# Altium schematic sheet High Voltage Power Supply.SchDoc: HVPS
size 431 x 279 mm; Date: Not shown in title block; ApprovedBy: Not shown in title block; CheckedBy: Not shown in title block; Author: Not shown in title block; CompanyName: Not shown in title block; DrawnBy: Abhishek Vishwa; Engineer: Not shown in title block; Organization: Not shown in title block; Address1: Not shown in title block; Address2: Not shown in title block; Address3: Not shown in title block; Address4: Not shown in title block; DocumentNumber: 1; Revision: Use project parameter SCH_Rev; SheetNumber: 10; SheetTotal: 12; PageSetup: Record=PageOptions|CenterHorizontal=True|CenterVertical=True|PrintScale=1.00|XCorrection=1.00|YCorrection=1.00|PrintKind=0|BorderSize=5000000|LeftOffset=0|BottomOffset=0|Orientation=2|PaperLength=1000|PaperWidth=1000|Scale=100|PaperSource=15|PrintQuality=600|MediaType=1|DitherType=10|PaperKind=Letter|PrintScaleMode=1; CurrentTime: Not shown in title block; CurrentDate: Not shown in title block; Time: Not shown in title block; DocumentFullPathAndName: Not shown in title block; DocumentName: Not shown in title block; ModifiedDate: Not shown in title block; ImagePath: Not shown in title block
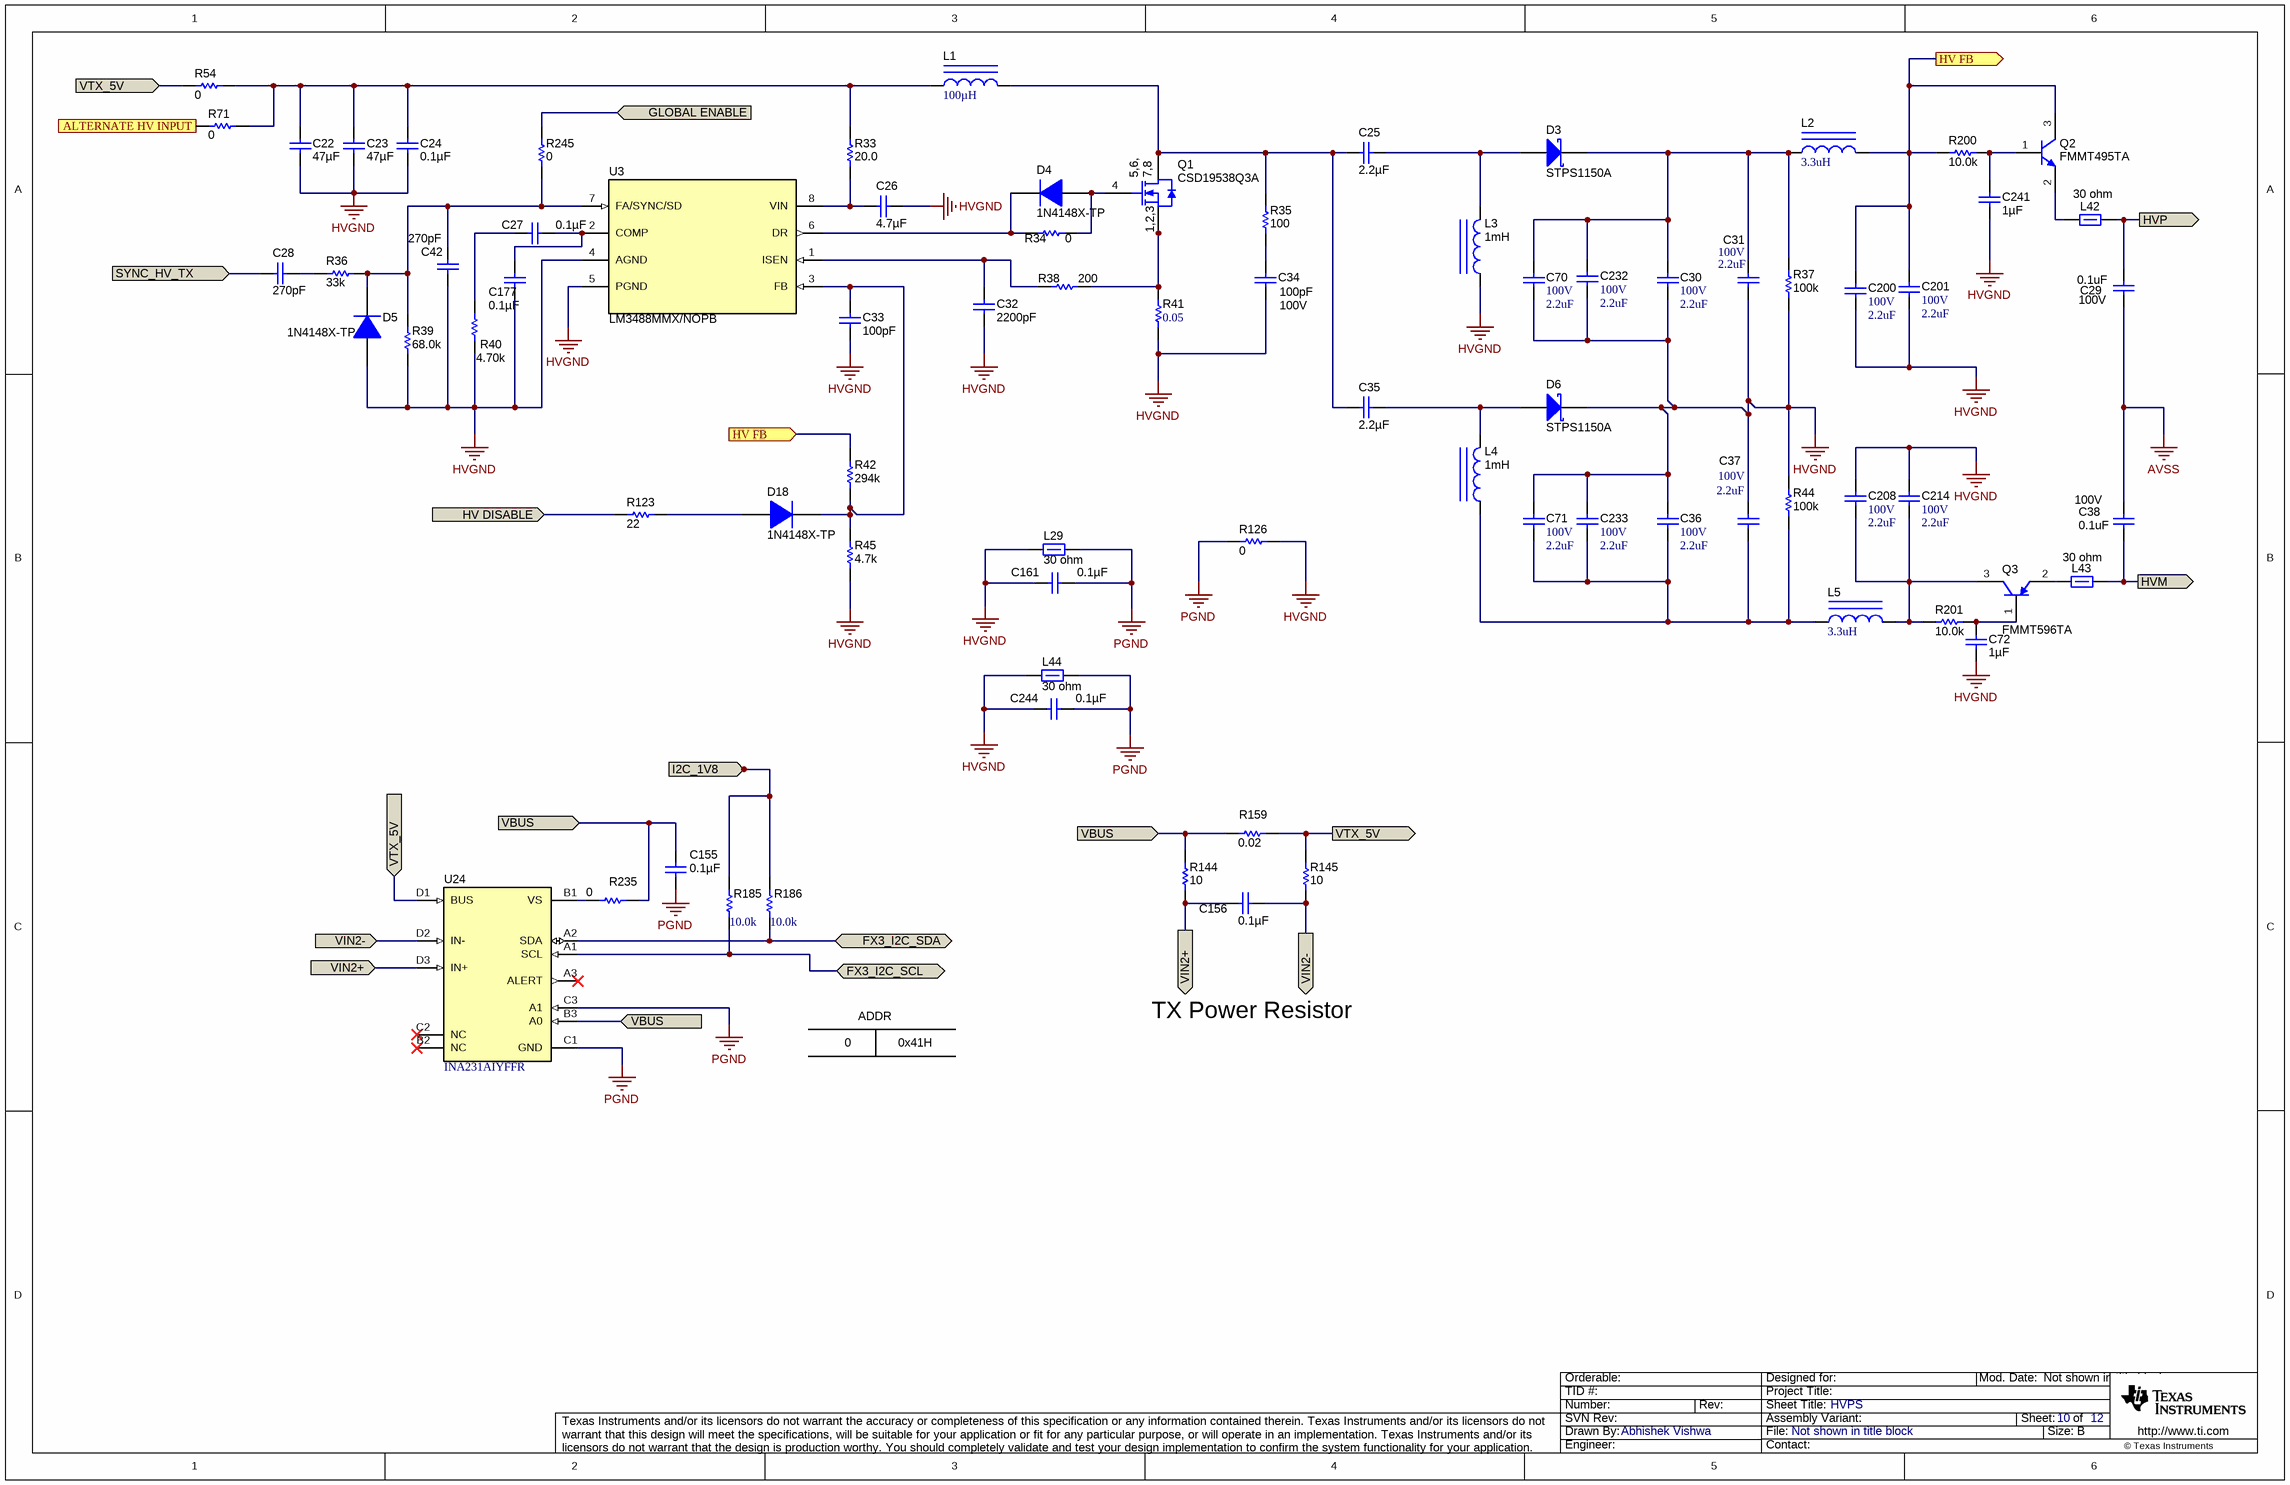
[diagram p0: High Voltage Power Supply.SchDoc]

## Parts
C22  ValueDisplayed: 47µF  [0805M]  (hidden comment: GRM21BR61A476ME15)
C23  ValueDisplayed: 47µF  [0805M]  (hidden comment: GRM21BR61A476ME15)
C24  ValueDisplayed: 0.1µF  [0805M]  (hidden comment: 08053C104KAT2A)
C25  ValueDisplayed: 2.2µF  [0805_HV]  (hidden comment: CGA4J3X7R1H225K125AB)
C26  ValueDisplayed: 4.7µF  [0603]  (hidden comment: GRM188C81E475KE11D)
C27  ValueDisplayed: 0.1µF  [0402]  (hidden comment: GRM155R61E104KA87D)
C28  ValueDisplayed: 270pF  [0603]  (hidden comment: GRM1885C1H271JA01D)
C29  VDC_V: 100V  ValueDisplayed: 0.1uF  [0603]  (hidden comment: GRM188R72A104KA35J)
C30  VDC_V: 100V  ValueDisplayed: 2.2uF  [1206_180]  (hidden comment: C3216X7S2A225K160AB)
C31  VDC_V: 100V  ValueDisplayed: 2.2uF  [1206_180]  (hidden comment: C3216X7S2A225K160AB)
C32  ValueDisplayed: 2200pF  [0402]  (hidden comment: 885012205027)  (graphical)
C33  ValueDisplayed: 100pF  [0402]  (hidden comment: 885012005061)
C34  VDC_V: 100V  ValueDisplayed: 100pF  [0603]  (hidden comment: GRM1885C2A101JA01D)
C35  ValueDisplayed: 2.2µF  [0805_HV]  (hidden comment: CGA4J3X7R1H225K125AB)
C36  VDC_V: 100V  ValueDisplayed: 2.2uF  [1206_180]  (hidden comment: C3216X7S2A225K160AB)
C37  VDC_V: 100V  ValueDisplayed: 2.2uF  [1206_180]  (hidden comment: C3216X7S2A225K160AB)
C38  VDC_V: 100V  ValueDisplayed: 0.1uF  [0603]  (hidden comment: GRM188R72A104KA35J)
C42  ValueDisplayed: 270pF  [0603]  (hidden comment: GRM1885C1H271JA01D)
C70  VDC_V: 100V  ValueDisplayed: 2.2uF  [1206_180]  (hidden comment: C3216X7S2A225K160AB)
C71  VDC_V: 100V  ValueDisplayed: 2.2uF  [1206_180]  (hidden comment: C3216X7S2A225K160AB)
C72  ValueDisplayed: 1µF  [0805_HV]  (hidden comment: C2012X7S2A105K125AB)
C155  ValueDisplayed: 0.1µF  [0201_033]  (hidden comment: C0603X6S1C104K030BC)
C156  ValueDisplayed: 0.1µF  [0201_033]  (hidden comment: C0603X6S1C104K030BC)
C161  ValueDisplayed: 0.1µF  [0402]  (hidden comment: GRM155R61E104KA87D)
C177  ValueDisplayed: 0.1µF  [0402]  (hidden comment: GRM155R61E104KA87D)
C200  VDC_V: 100V  ValueDisplayed: 2.2uF  [1206_180]  (hidden comment: C3216X7S2A225K160AB)
C201  VDC_V: 100V  ValueDisplayed: 2.2uF  [1206_180]  (hidden comment: C3216X7S2A225K160AB)
C208  VDC_V: 100V  ValueDisplayed: 2.2uF  [1206_180]  (hidden comment: C3216X7S2A225K160AB)
C214  VDC_V: 100V  ValueDisplayed: 2.2uF  [1206_180]  (hidden comment: C3216X7S2A225K160AB)
C232  VDC_V: 100V  ValueDisplayed: 2.2uF  [1206_180]  (hidden comment: C3216X7S2A225K160AB)
C233  VDC_V: 100V  ValueDisplayed: 2.2uF  [1206_180]  (hidden comment: C3216X7S2A225K160AB)
C241  ValueDisplayed: 1µF  [0805_HV]  (hidden comment: C2012X7S2A105K125AB)
C244  ValueDisplayed: 0.1µF  [0402]  (hidden comment: GRM155R61E104KA87D)
D3  STPS1150A  [SMA]
D4  1N4148X-TP  [SOD-523]
D5  1N4148X-TP  [SOD-523]
D6  STPS1150A  [SMA]
D18  1N4148X-TP  [SOD-523]
L1  ValueDisplayed: 100µH  [WE-LQS_8040]  (hidden comment: 74404084101)
L2  ValueDisplayed: 3.3uH  [0805_HV]  (hidden comment: 74479775233)
L3  ValueDisplayed: 1mH  [WE-TPC_4828]  (hidden comment: 744043102)
L4  ValueDisplayed: 1mH  [WE-TPC_4828]  (hidden comment: 744043102)
L5  ValueDisplayed: 3.3uH  [0805_HV]  (hidden comment: 74479775233)
L29  ValueDisplayed: 30 ohm  [0603]  (hidden comment: 742792609)
L42  ValueDisplayed: 30 ohm  [0603]  (hidden comment: 742792609)
L43  ValueDisplayed: 30 ohm  [0603]  (hidden comment: 742792609)
L44  ValueDisplayed: 30 ohm  [0603]  (hidden comment: 742792609)
Q1  CSD19538Q3A  [DNH0008A]
Q2  FMMT495TA  [SOT-23]
Q3  FMMT596TA  [SOT-23]
R33  ValueDisplayed: 20.0  [0603]  (hidden comment: RT0603BRD0720RL)
R34  ValueDisplayed: 0  [0603]  (hidden comment: RC0603JR-070RL)
R35  ValueDisplayed: 100  [0603]  (hidden comment: CRCW0603100RJNEA)
R36  ValueDisplayed: 33k  [0603]  (hidden comment: RC0603JR-0733KL)
R37  ValueDisplayed: 100k  [0603]  (hidden comment: CRCW0603100KJNEAC)
R38  ValueDisplayed: 200  [0603]  (hidden comment: CRCW0603200RFKEA)
R39  ValueDisplayed: 68.0k  [0603]  (hidden comment: RC0603FR-0768KL)
R40  ValueDisplayed: 4.70k  [0402]  (hidden comment: ERJ-2RKF4701X)
R41  ValueDisplayed: 0.05  [2010]
R42  ValueDisplayed: 294k  [0603]  (hidden comment: ERJ-3EKF2943V)
R44  ValueDisplayed: 100k  [0603]  (hidden comment: CRCW0603100KJNEAC)
R45  ValueDisplayed: 4.7k  [0603]  (hidden comment: ERA-3AEB5111V)
R54  ValueDisplayed: 0  [5106]  (hidden comment: 5106)
R71  ValueDisplayed: 0  [5106]  (hidden comment: 5106)
R123  ValueDisplayed: 22  [0402]  (hidden comment: CRCW040222R0JNED)
R126  ValueDisplayed: 0  [5106]  (hidden comment: 5106)
R144  ValueDisplayed: 10  [0201]  (hidden comment: RC0201JR-0710RL)
R145  ValueDisplayed: 10  [0201]  (hidden comment: RC0201JR-0710RL)
R159  ValueDisplayed: 0.02  [1206]  (hidden comment: CSR1206FK20L0)
R185  ValueDisplayed: 10.0k  [0201]  (hidden comment: RC0201FS-7D10KL)
R186  ValueDisplayed: 10.0k  [0201]  (hidden comment: RC0201FS-7D10KL)
R200  ValueDisplayed: 10.0k  [0603]  (hidden comment: RT0603BRD0710KL)
R201  ValueDisplayed: 10.0k  [0603]  (hidden comment: RT0603BRD0710KL)
R235  ValueDisplayed: 0  [0201]  (hidden comment: ERJ-1GN0R00C)
R245  ValueDisplayed: 0  [0402]  (hidden comment: ERJ-2GE0R00X)
U3  LM3488MMX/NOPB  [DGK0008A_N]
U24  INA231AIYFFR  [YFF0012AKAD]

## Ports
ALTERNATE HV INPUT (in), FX3_I2C_SCL (bidir), FX3_I2C_SDA (bidir), GLOBAL ENABLE (in), HV DISABLE (in), HV FB (in), HV FB (out), HVM (out), HVP (out), I2C_1V8 (in), SYNC_HV_TX (in), VBUS (in), VIN2+ (in), VIN2+ (out), VIN2- (in), VIN2- (out), VTX_5V (in), VTX_5V (out)

## Nets
AVSS: C29.2 C38.1
HVGND: C22.2 C23.2 C24.2 C26.1 C30.2 C31.2 C32.2 C33.2 C34.2 C36.1 C37.1 C42.2 C70.2 C71.1 C72.2 C161.2 C177.2 C200.2 C201.2 C208.1 C214.1 C232.2 C233.1 C241.2 C244.2 D5.2(A) D6.1(K) L3.1 L29.1 L44.1 R37.1 R39.1 R40.1 R41.1 R44.2 R45.1 R126.2 U3.4(AGND) U3.5(PGND)
PGND: C155.2 C161.1 C244.1 L29.2 L44.2 R126.1 U24.C1(GND) U24.C3(A1)
ALTERNATE HV INPUT: R71.1 ; port ALTERNATE HV INPUT
FX3_I2C_SCL: R185.1 U24.A1(SCL) ; port FX3_I2C_SCL
FX3_I2C_SDA: R186.1 U24.A2(SDA) ; port FX3_I2C_SDA
GLOBAL ENABLE: R245.1 ; port GLOBAL ENABLE
HV DISABLE: R123.1 ; port HV DISABLE
HV FB: C200.1 C201.1 L2.2 Q2.3(C) R42.2 R200.1 ; port HV FB
HVM: C38.2 L43.2 ; port HVM
HVP: C29.1 L42.2 ; port HVP
I2C_1V8: R185.2 R186.2 ; port I2C_1V8
SYNC_HV_TX: C28.1 ; port SYNC_HV_TX
VBUS: C155.1 R144.2 R159.1 R235.2 U24.B3(A0) ; port VBUS
VIN2+: C156.1 R144.1 U24.D3(IN+) ; port VIN2+
VIN2-: C156.2 R145.1 U24.D2(IN-) ; port VIN2-
VTX_5V: R54.1 R145.2 R159.2 U24.D1(BUS) ; port VTX_5V
NetC22_1: C22.1 C23.1 C24.1 L1.1 R33.2 R54.2 R71.2
NetC25_1: C25.1 D3.2(A) L3.2
NetC25_2: C25.2 C35.2 L1.2 Q1.5(D) Q1.6(D) Q1.7(D) Q1.8(D) Q1.9(D) R35.2
NetC26_2: C26.2 R33.1 U3.8(VIN)
NetC27_1: C27.1 C177.1 U3.2(COMP)
NetC27_2: C27.2 R40.2
NetC28_2: C28.2 R36.1
NetC30_1: C30.1 C31.1 C70.1 C232.1 D3.1(K) L2.1 R37.2
NetC32_1: C32.1 R38.1 U3.1(ISEN)
NetC33_1: C33.1 D18.1(K) R42.1 R45.2 U3.3(FB)
NetC34_1: C34.1 R35.1
NetC35_1: C35.1 D6.2(A) L4.2
NetC36_2: C36.2 C37.2 C71.2 C233.2 L4.1 L5.1 R44.1
NetC42_1: C42.1 D5.1(K) R36.2 R39.2 R245.2 U3.7(FA/SYNC/SD)
NetC72_1: C72.1 Q3.1(B) R201.2
NetC208_2: C208.2 C214.2 L5.2 Q3.3(C) R201.1
NetC241_1: C241.1 Q2.1(B) R200.2
NetD4_1: D4.1(K) R34.1 U3.6(DR)
NetD4_2: D4.2(A) Q1.4(G) R34.2
NetD18_2: D18.2(A) R123.2
NetL42_1: L42.1 Q2.2(E)
NetL43_1: L43.1 Q3.2(E)
NetQ1_1: Q1.1(S) Q1.2(S) Q1.3(S) R38.2 R41.2
NetR235_1: R235.1 U24.B1(VS)

Not connected (* = marked no-connect by the designer): U24 A3(ALERT)* B2(NC)* C2(NC)*

## Notes on the sheet
- 0
- ADDR
- 0x41H
- TX Power Resistor
- Drawn By:
- SVN Rev:
- Number:
- TID #:
- Orderable:
- Rev:
- Sheet Title:
- File:
- Project Title:
- Designed for:
- Assembly Variant:
- Mod. Date:
- Sheet:
- Size:
- of
- B
- http://www.ti.com
- Texas Instruments and/or its licensors do not warrant the accuracy or completeness of this specification or any information contained therein. Texas Instruments and/or its licensors do not warrant that this design will meet the specifications, will be suitable for your application or fit for any particular purpose, or will operate in an implementation. Texas Instruments and/or its licensors do not warrant that the design is production worthy. You should completely validate and test your design implementation to confirm the system functionality for your application.
- Engineer:
- Contact:
- © Texas Instruments
- (in symbol CMP-0000969-3) 5,6,; 7,8; 1,2,3

## Library data of the parts
C22 C23 = GRM21BR61A476ME15: CAP, CERM, 47 µF, 10 V,+/- 20%, X5R, 0805; Manufacturer: MuRata; Polarized: N; CompType: Capacitor; Value: 47uF; U/M: EA; Cap_F: 0.000047; Tolerance_%: 20; VDC_V: 10; Value2: 10V; TaMin_C: -55; TaMax_C: 85; Cap_Case: 0805; SizeArea_mm2: 2.5; SizeAreaWB_mm2: 6.75; SizeX_mm: 2; SizeY_mm: 1.25; SizeZ_mm: 1.45; AEC Category: Q200; Green_Lifecycle: Active; Green_REACh: Passed; SymbolVersion: 2008-07-09; PartNumber: GRM21BR61A476ME15; PackageReference: 0805; RoHS: Y; MountType: SMT; Technology: Ceramic; TempCo: X5R; Published: 2008-06-19; Publisher: Texas Instruments; LatestRevisionDate: 2017-06-22; ComponentLink1Description: Datasheet link; ComponentLink1URL: http://www.murata.com/~/media/webrenewal/support/library/catalog/products/capacitor/mlcc/c02e.ashx; AEC Qualified: ?; Green_EU RoHS: Passed; Green_EU RoHS-2: Incomplete
C24 = 08053C104KAT2A: CAP, CERM, 0.1 µF, 25 V,+/- 10%, X7R, 0805; Manufacturer: AVX; Polarized: N; CompType: Capacitor; Value: 0.1uF; U/M: EA; Cap_F: 0.0000001; Tolerance_%: 10; ESR_ohm: 0.28; Value1: 0.28 ohm; VDC_V: 25; Value2: 25V; TaMin_C: -55; TaMax_C: 125; Cap_Case: 0805; SizeArea_mm2: 2.5; SizeAreaWB_mm2: 6.75; SizeX_mm: 2; SizeY_mm: 1.25; SizeZ_mm: 1.45; AEC Category: Q200; Green_Lifecycle: Active; Green_REACh: Passed; SymbolVersion: 2008-07-09; PartNumber: 08053C104KAT2A; PackageReference: 0805; RoHS: Y; MountType: SMT; Technology: Ceramic; TempCo: X7R; Published: 2008-06-19; Publisher: Texas Instruments; LatestRevisionDate: 2017-06-22; ComponentLink1Description: Datasheet link; ComponentLink1URL: http://datasheets.avx.com/X7RDielectric.pdf; Supplier 1: Digi-Key; Supplier Part Number 1: 478-3755-1-ND; Supplier 2: Newark; Supplier Part Number 2: 96M1381; Supplier 3: Mouser; Supplier Part Number 3: 581-08053C104K; AEC Qualified: N; AEC Grade: N/A; Green_EU RoHS: Passed; Green_EU RoHS-2: Incomplete
C25 C35 = CGA4J3X7R1H225K125AB: CAP, CERM, 2.2 µF, 50 V,+/- 10%, X7R, AEC-Q200 Grade 1, 0805; Manufacturer: TDK; Polarized: N; CompType: Capacitor; Value: 2.2uF; U/M: EA; Cap_F: 0.0000022; Tolerance_%: 10; ESR_ohm: 0.003288; Value1: 0.003288 ohm; VDC_V: 50; Value2: 50V; IRMS_A: 3.60029; TaMin_C: -55; TaMax_C: 125; Cap_Case: 0805; SizeArea_mm2: 2.5; SizeAreaWB_mm2: 6.75; SizeX_mm: 2; SizeY_mm: 1.25; SizeZ_mm: 1.45; AEC Category: Q200; AEC Qualified: Y; AEC Grade: 1; SymbolVersion: 2008-07-09; PartNumber: CGA4J3X7R1H225K125AB; PackageReference: 0805; RoHS: Y; MountType: SMT; Technology: Ceramic; TempCo: X7R; Published: 2008-06-19; Publisher: Texas Instruments; LatestRevisionDate: 2017-06-22; ComponentLink1Description: Datasheet link; ComponentLink1URL: https://product.tdk.com/en/search/capacitor/ceramic/mlcc/info?part_no=CGA4J3X7R1H225K125AB; Supplier 1: Digi-Key; Supplier Part Number 1: 445-174216-1-ND; Supplier 2: Mouser; Supplier Part Number 2: 810-CGA4J3X7R1H225K125AB
C26 = GRM188C81E475KE11D: CAP, CERM, 4.7 µF, 25 V,+/- 10%, X6S, 0603; Manufacturer: MuRata; Polarized: N; CompType: Capacitor; Value: 4.7uF; U/M: EA; Cap_F: 0.0000047; Tolerance_%: 10; VDC_V: 25; Value2: 25V; TaMin_C: -55; TaMax_C: 105; SizeArea_mm2: 1.28; SizeAreaWB_mm2: 4.68; SizeX_mm: 1.6; SizeY_mm: 0.8; SizeZ_mm: 1; AEC Category: Q200; SymbolVersion: 2008-07-09; PartNumber: GRM188C81E475KE11D; PackageReference: 0603; RoHS: Y; MountType: SMT; Technology: Ceramic; TempCo: X6S; Cap_Case: 0603; Published: 2008-06-19; Publisher: Texas Instruments; LatestRevisionDate: 2017-06-22; ComponentLink1Description: Datasheet link; ComponentLink1URL: http://search.murata.co.jp/Ceramy/image/img/A01X/G101/ENG/GRM188C81E475KE11-01.pdf; Supplier 1: Digi-Key; Supplier Part Number 1: 490-7199-1-ND; Supplier 2: Mouser; Supplier Part Number 2: 81-GRM188C81E475KE1D; AEC Qualified: N; AEC Grade: N/A
C27 C161 C177 C244 = GRM155R61E104KA87D: CAP, CERM, 0.1 µF, 25 V,+/- 10%, X5R, 0402; Manufacturer: MuRata; Polarized: N; CompType: Capacitor; Value: 0.1uF; U/M: EA; Cap_F: 0.0000001; Tolerance_%: 10; VDC_V: 25; Value2: 25V; TaMin_C: -55; TaMax_C: 85; SizeArea_mm2: 0.5; SizeAreaWB_mm2: 3; SizeX_mm: 1; SizeZ_mm: 0.6; AEC Category: Q200; Green_Lifecycle: Active; Green_REACh: Passed; SymbolVersion: 2008-07-09; PartNumber: GRM155R61E104KA87D; PackageReference: 0402; RoHS: Y; MountType: SMT; Technology: Ceramic; TempCo: X5R; Cap_Case: 0402; SizeY_mm: 0.5; Published: 2008-06-19; Publisher: Texas Instruments; LatestRevisionDate: 2017-06-22; ComponentLink1Description: Datasheet link; ComponentLink1URL: http://psearch.murata.com/capacitor/product/GRM155R61E104KA87%23.pdf; Supplier 1: Digi-Key; Supplier Part Number 1: 490-5920-1-ND; Supplier 2: Mouser; Supplier Part Number 2: 81-GRM155R61E104KA7D; AEC Qualified: N; AEC Grade: N/A; Green_EU RoHS: Passed; Green_EU RoHS-2: Passed
C28 C42 = GRM1885C1H271JA01D: CAP, CERM, 270 pF, 50 V,+/- 5%, C0G/NP0, 0603; Manufacturer: MuRata; Polarized: N; CompType: Capacitor; Value: 270pF; U/M: EA; Cap_F: 0.00000000027; Tolerance_%: 5; VDC_V: 50; Value2: 50V; TaMin_C: -55; TaMax_C: 125; SizeArea_mm2: 1.28; SizeAreaWB_mm2: 4.68; SizeX_mm: 1.6; SizeY_mm: 0.8; SizeZ_mm: 1; AEC Category: Q200; Green_Lifecycle: Active; Green_REACh: Passed; SymbolVersion: 2008-07-09; PartNumber: GRM1885C1H271JA01D; PackageReference: 0603; RoHS: Y; MountType: SMT; Technology: Ceramic; TempCo: C0G/NP0; Cap_Case: 0603; Published: 2008-06-19; Publisher: Texas Instruments; LatestRevisionDate: 2017-06-22; ComponentLink1Description: Datasheet link; ComponentLink1URL: http://search.murata.co.jp/Ceramy/PnsearchViewAction.do?HnOFG=ON&HnNFG=ON&SEL_CNT=50&sLang=en&sKey=GRM1885C1H271JA01D&x=9&y=9&search=startwith; Supplier 1: Digi-Key; Supplier Part Number 1: 490-1437-1-ND; Supplier 2: Mouser; Supplier Part Number 2: 81-GRM39C271J50; Supplier 3: Farnell; Supplier Part Number 3: 1403568; AEC Qualified: ?; Green_EU RoHS: Passed; Green_EU RoHS-2: Incomplete
C29 C38 = CMP-0007470-5: CAP, CERM, 0.1 uF, 100 V, +/- 10%, X7R, 0603; Manufacturer: MuRata; TaMin_C: -55°C; Polarized: N; SizeAreaWB_mm2: 4.68; Value1: Unknown; U/M: EA; Value: 0.1uF; TaMax_C: 125°C; SizeZ_mm: 1; SizeX_mm: 1.6; SizeY_mm: 0.8; SizeArea_mm2: 1.28; Cap_F: 100nF; AEC Category: Q200; Supplier Part Number 2: 81-GRM188R72A104KA5J; Publisher: Texas Instruments; Supplier 2: Mouser; TempCo: X7R; Published: 2008-06-19; RoHS: Y; MountType: SMT; Supplier 1: Digi-Key; PackageReference: 0603; Tolerance_%: 10%; Cap_Case: 0603; Value2: 100V; CompType: Capacitor; LatestRevisionDate: 2017-03-09; PartNumber: GRM188R72A104KA35J; AEC Qualified: ?; ComponentLink1Description: Datasheet link; Supplier Part Number 1: 490-6439-1-ND; Technology: Ceramic; ComponentLink1URL: http://search.murata.co.jp/Ceramy/image/img/A01X/G101/ENG/GRM188R72A104KA35-01.pdf
C30 C31 C36 C37 C70 C71 C200 C201 C208 C214 C232 C233 = CMP-0008724-2: CAP, CERM, 2.2 uF, 100 V, +/- 10%, X7S, 1206; Manufacturer: TDK; TaMin_C: -55°C; ESR_ohm: 5.718m; Polarized: N; SizeAreaWB_mm2: 10.92; Value1: 0.005718 ohm; U/M: EA; Value: 2.2uF; TaMax_C: 125°C; SizeZ_mm: 1.8; SizeX_mm: 3.2; SizeY_mm: 1.6; SizeArea_mm2: 5.12; Cap_F: 2.2µF; IRMS_A: 3.03632A; AEC Category: Q200; Supplier Part Number 2: 810-C3216X7S2A225K160AB; Publisher: Texas Instruments; Supplier 2: Mouser; TempCo: X7S; Published: 2008-06-19; RoHS: Y; MountType: SMT; Supplier 1: Digi-Key; PackageReference: 1206; Tolerance_%: 10%; Cap_Case: 1206_180; Value2: 100V; CompType: Capacitor; LatestRevisionDate: 2017-03-09; PartNumber: C3216X7S2A225K160AB; AEC Qualified: N; ComponentLink1Description: Datasheet link; AEC Grade: N/A; Supplier Part Number 1: 445-5207-1-ND; Technology: Ceramic; ComponentLink1URL: https://product.tdk.com/en/search/capacitor/ceramic/mlcc/info?part_no=C3216X7S2A225K160AB
C32 = GRM155R61C222KA01D: CAP, CERM, 2200 pF, 16 V,+/- 10%, X7R, 0402; Manufacturer: Wurth Electronics Inc.; Polarized: N; CompType: Capacitor; Value: 2200pF; U/M: EA; Cap_F: 0.0000000022; Tolerance_%: 10; VDC_V: 16; Value2: 16V; TaMin_C: -55; TaMax_C: 85; SizeArea_mm2: 0.5; SizeAreaWB_mm2: 3; SizeX_mm: 1; SizeZ_mm: 0.6; AEC Category: Q200; SymbolVersion: 2008-07-09; PartNumber: 885012205027; PackageReference: 0402; RoHS: Y; MountType: SMT; Technology: Ceramic; TempCo: X7R; Cap_Case: 0402; SizeY_mm: 0.5; Published: 2008-06-19; Publisher: Texas Instruments; LatestRevisionDate: 2017-06-22; ComponentLink1Description: Datasheet link; ComponentLink1URL: http://search.murata.co.jp/Ceramy/PnsearchViewAction.do?HnOFG=ON&HnNFG=ON&SEL_CNT=50&sLang=en&sKey=GRM155R61C222KA01D&x=9&y=9&search=startwith; Supplier 1: Digi-Key; Supplier Part Number 1: 732-7522-6-ND; Supplier 2: Mouser; AEC Qualified: ?; Parameter 1: *; Parameter 2: *
C33 = 885012005061: CAP, CERM, 100 pF, 50 V,+/- 5%, C0G/NP0, 0402; Manufacturer: Wurth Elektronik; Polarized: N; CompType: Capacitor; Value: 100pF; U/M: EA; Cap_F: 0.0000000001; Tolerance_%: 5; VDC_V: 50; Value2: 50V; TaMin_C: -55; TaMax_C: 125; SizeArea_mm2: 0.5; SizeAreaWB_mm2: 3; SizeX_mm: 1; SizeZ_mm: 0.6; AEC Category: Q200; Green_Lifecycle: Not Set; Green_REACh: Incomplete; SymbolVersion: 2008-07-09; PartNumber: 885012005061; PackageReference: 0402; RoHS: Y; MountType: SMT; Technology: Ceramic; TempCo: C0G/NP0; Cap_Case: 0402; SizeY_mm: 0.5; Published: 2008-06-19; Publisher: Texas Instruments; LatestRevisionDate: 2017-06-22; ComponentLink1Description: Datasheet link; ComponentLink1URL: http://katalog.we-online.de/pbs/datasheet/885012005061.pdf; Supplier 1: Digi-Key; Supplier Part Number 1: 732-7475-1-ND; Supplier 2: Mouser; Supplier Part Number 2: 710-885012005061; AEC Qualified: N; AEC Grade: N/A; Green_EU RoHS: Incomplete; Green_EU RoHS-2: Incomplete
C34 = CMP-0007237-4: CAP, CERM, 100 pF, 100 V, +/- 5%, C0G/NP0, 0603; Manufacturer: MuRata; TaMin_C: -55°C; Polarized: N; SizeAreaWB_mm2: 4.68; Value1: Unknown; U/M: EA; Value: 100pF; TaMax_C: 125°C; SizeZ_mm: 1; SizeX_mm: 1.6; SizeY_mm: 0.8; SizeArea_mm2: 1.28; AEC Category: Q200; Supplier Part Number 2: 81-GRM1885C2A101JA01; Publisher: Texas Instruments; Supplier 2: Mouser; Supplier Part Number 3: 1828919; TempCo: C0G/NP0; Supplier 3: Farnell; Published: 2008-06-19; RoHS: Y; MountType: SMT; Supplier 1: Digi-Key; PackageReference: 0603; Tolerance_%: 5%; Cap_Case: 0603; Value2: 100V; CompType: Capacitor; LatestRevisionDate: 2017-03-09; PartNumber: GRM1885C2A101JA01D; AEC Qualified: ?; Cap_F: 100pF; ComponentLink1Description: Datasheet link; Supplier Part Number 1: 490-1351-1-ND; Technology: Ceramic; ComponentLink1URL: http://search.murata.co.jp/Ceramy/PnsearchViewAction.do?HnOFG=ON&HnNFG=ON&SEL_CNT=50&sLang=en&sKey=GRM1885C2A101JA01D&x=9&y=9&search=startwith
C72 C241 = C2012X7S2A105K125AB: CAP, CERM, 1 µF, 100 V,+/- 10%, X7S, 0805; Manufacturer: TDK; Polarized: N; CompType: Capacitor; Value: 1uF; U/M: EA; Cap_F: 0.000001; Tolerance_%: 10; ESR_ohm: 0.008255; Value1: 0.008255 ohm; VDC_V: 100; Value2: 100V; IRMS_A: 2.27442; TaMin_C: -55; TaMax_C: 125; Cap_Case: 0805; SizeArea_mm2: 2.5; SizeAreaWB_mm2: 6.75; SizeX_mm: 2; SizeY_mm: 1.25; SizeZ_mm: 1.45; AEC Category: Q200; Green_Lifecycle: Active; Green_REACh: Passed; SymbolVersion: 2008-07-09; PartNumber: C2012X7S2A105K125AB; PackageReference: 0805; RoHS: Y; MountType: SMT; Technology: Ceramic; TempCo: X7S; Published: 2008-06-19; Publisher: Texas Instruments; LatestRevisionDate: 2017-06-22; ComponentLink1Description: Datasheet link; ComponentLink1URL: https://product.tdk.com/en/search/capacitor/ceramic/mlcc/info?part_no=C2012X7S2A105K125AB; Supplier 1: Digi-Key; Supplier Part Number 1: 445-5205-1-ND; Supplier 2: Newark; Supplier Part Number 2: 90R8332; Supplier 3: Mouser; Supplier Part Number 3: 810-C2012X7S2A105K; AEC Qualified: N; AEC Grade: N/A; Green_EU RoHS: Passed; Green_EU RoHS-2: Passed
C155 C156 = C0603X6S1C104K030BC: CAP, CERM, 0.1 µF, 16 V,+/- 10%, X6S, 0201; Manufacturer: TDK; Polarized: N; CompType: Capacitor; Value: 0.1uF; U/M: EA; Cap_F: 0.0000001; Tolerance_%: 10; VDC_V: 16; Value2: 16V; TaMin_C: -55; TaMax_C: 105; Cap_Case: 0201; SizeArea_mm2: 0.18; SizeAreaWB_mm2: 2.08; SizeX_mm: 0.6; SizeY_mm: 0.3; SizeZ_mm: 0.33; AEC Category: Q200; SymbolVersion: 2008-07-09; PartNumber: C0603X6S1C104K030BC; PackageReference: 0201; RoHS: Y; MountType: SMT; Technology: Ceramic; TempCo: X6S; Published: 2008-06-19; Publisher: Texas Instruments; LatestRevisionDate: 2017-06-22; ComponentLink1Description: Datasheet link; ComponentLink1URL: http://product.tdk.com/en/catalog/datasheets/mlcc_commercial_general_en.pdf; Supplier 1: Digi-Key; Supplier Part Number 1: 445-15903-1-ND; Supplier 2: Newark; Supplier Part Number 2: 17X8592; Supplier 3: Mouser; Supplier Part Number 3: 810-C0603X6S1C104KBC; AEC Qualified: N; AEC Grade: N/A
D3 D6 = STPS1150A: Diode, Schottky, 150 V, 1 A, SMA; Manufacturer: STMicroelectronics; U/M: EA; Vf_V: 0.78; Value: 150V; Value1: 1A; Value2: 0.78V; Io_A: 1; Vr_V: 150; TJmax_C: 175; RJC_CperW: 30; SizeAreaWB_mm2: 37.3428; SizeArea_mm2: 16.3228; SizeX_mm: 5.59; SizeY_mm: 2.92; SizeZ_mm: 2.87; AEC Category: Q101; AEC Qualified: N; Green_Lifecycle: Not Set; Green_REACh: Incomplete; CompType: Diode; SymbolVersion: 2008-12-08; PartNumber: STPS1150A; PackageReference: SMA; MountType: SMT; Type: Schottky; RoHS: Y; Published: 2008-06-26; Publisher: Texas Instruments; LatestRevisionDate: 2017-06-26; ComponentLink1Description: Datasheet link; ComponentLink1URL: http://www.st.com/web/en/resource/technical/document/datasheet/CD00003321.pdf; Supplier 1: Digi-Key; Supplier Part Number 1: 497-7545-1-ND; Supplier 2: Newark; Supplier Part Number 2: 57P1608; Supplier 3: Mouser; Supplier Part Number 3: 511-STPS1150A; Green_EU RoHS: Incomplete; Green_EU RoHS-2: Incomplete
D4 D5 D18 = 1N4148X-TP: Diode, Switching, 75 V, 0.3 A, SOD-523; Manufacturer: Micro Commercial Components; U/M: EA; Vf_V: 1.25; Value: 75V; Value1: 0.3A; Value2: 1.25V; Io_A: 0.3; Vr_V: 75; TJmax_C: 150; SizeAreaWB_mm2: 5.13; SizeArea_mm2: 1.53; SizeX_mm: 1.7; SizeY_mm: 0.9; SizeZ_mm: 0.65; AEC Category: Q101; Green_Lifecycle: Not Set; Green_REACh: Incomplete; SymbolVersion: 2008-12-08; PartNumber: 1N4148X-TP; PackageReference: SOD-523; CompType: Diode; MountType: SMT; Type: Switching; RoHS: Y; Published: 2008-06-26; Publisher: Texas Instruments; LatestRevisionDate: 2017-06-26; ComponentLink1Description: Datasheet link; ComponentLink1URL: http://www.mccsemi.com/up_pdf/1N4148X(SOD-523).PDF; Supplier 1: Digi-Key; Supplier Part Number 1: 1N4148XTPMSCT-ND; Supplier 2: Newark; Supplier Part Number 2: 69R6666; Supplier 3: Mouser; Supplier Part Number 3: 833-1N4148X-TP; AEC Qualified: ?; Green_EU RoHS: Incomplete; Green_EU RoHS-2: Incomplete
L1 = CMP-0086317-1: Inductor, Shielded, Ferrite, 100 µH, 1.2 A, 0.377 ohm, SMD; Manufacturer: Wurth Elektronik; Value: 100uH; Imax_A: 1.2A; SizeArea_mm2: 64; SizeX_mm: 8; Isat: 1.5A @ 20% inductance drop; SizeZ_mm: 4.2; SizeAreaWB_mm2: 100; DCR_ohm: 0.377; AEC Category: Q200; AEC Qualified: N; Irms: 1.2A @ 40C rise; Material: Ferrite; ComponentLink1URL: https://katalog.we-online.de/pbs/datasheet/74404084101.pdf; CompType: Inductor; Value2: 1.2A; MountType: SMT; Technology: Shielded; AEC Grade: N/A; PackageReference: 8x8mm; ComponentLink1Description: Datasheet link; RoHS: Y; Value1: 0.377 ohm; PartNumber: 74404084101; SizeY_mm: 8; Ind_H: 100µH
L2 L5 = CMP-0062218-1: FIXED IND 3.3UH 700MA 200 MOHM; Manufacturer: Wurth; Green_Lifecycle: Not Set; DCR_ohm: 3.32d; Green_REACh: Incomplete; Value1: 0.2 ohm; Material: Ferrite; Value: 3.3; Imax_A: 8.5dA; Value2: 0.7; CompType: Inductor; AEC Category: Q200; ComponentLink1URL: http://www.sumida.com/products/pdf/CDH3D13DSHP.pdf; Irms: 700 mA; Supplier Part Number 2: 74479775233; Publisher: Texas Instruments; Supplier 2: Mouser; Published: 2008-06-26; RoHS: Y; MountType: SMT; Green_EU RoHS-2: Incomplete; Supplier 1: Digi-Key; Green_EU RoHS: Incomplete; PackageReference: 0805; Ind_H: 3.3uH; LatestRevisionDate: 2017-06-02; PartNumber: 74479775233; AEC Qualified: ?; ComponentLink1Description: Datasheet link; Supplier Part Number 1: 74479775233; Technology: Drum Core
L3 L4 = CMP-0064699-2: Inductor, Shielded Drum Core, Metal Composite, 1mH, 0.08 A, 5.4 ohm, SMD; Manufacturer: Wurth Elektronik; Isat: 0.08A @ 35% inductance drop; Irms: 0.14A @ 30C rise; Green_Lifecycle: Active; SizeAreaWB_mm2: 33.64; DCR_ohm: 5.4; Green_REACh: Passed; Value1: 5.4 ohm; Imax_A: 0.08A; SizeZ_mm: 3; SizeX_mm: 4.8; SizeArea_mm2: 23.04; Ind_H: 470µH; AEC Category: Q200; Publisher: Texas Instruments; Published: 2008-06-26; RoHS: Y; Material: Metal Composite; MountType: SMT; Green_EU RoHS-2: Incomplete; Value: 1mH; Supplier 1: Digi-Key; Green_EU RoHS: Passed; PackageReference: WE-TPC-M2; SizeY_mm: 4.8; Value2: 0.08A; CompType: Inductor; LatestRevisionDate: 2017-06-02; PartNumber: 744043102; AEC Qualified: ?; ComponentLink1Description: Datasheet link; Supplier Part Number 1: 732-3662-1-ND; Technology: Shielded Drum Core; ComponentLink1URL: https://katalog.we-online.de/pbs/datasheet/744043102.pdf
L29 L42-L44 = 742792609: Ferrite Bead, 30 ohm @ 100 MHz, 3 A, 0603; Manufacturer: Wurth Elektronik; Value: 30 ohm; Imax_A: 3; DCR_ohm: 0.04; Value1: 0.04 ohm; Value2: 3A; SizeAreaWB_mm2: 4.68; SizeArea_mm2: 1.28; SizeX_mm: 1.6; SizeY_mm: 0.8; SizeZ_mm: 1; ZTyp@100MHz_Ohm: 30; Ztyp@1GHz_Ohm: 40.472; Green_Lifecycle: Active; Green_REACh: Passed; SymbolVersion: 2017-01-06; PartNumber: 742792609; CompType: Ferrite Bead; MountType: SMT; PackageReference: 0603; Published: 2014-04-30; Publisher: Texas Instruments; LatestRevisionDate: 2017-06-22; ComponentLink1Description: Datasheet link; ComponentLink1URL: http://katalog.we-online.de/pbs/datasheet/742792609.pdf; RoHS: Y; Supplier 1: Digi-Key; Supplier Part Number 1: 732-1591-1-ND; Supplier 2: Mouser; Supplier Part Number 2: 710-742792609; Green_EU RoHS: Passed; Green_EU RoHS-2: Incomplete
Q1 = CMP-0000969-3: MOSFET, N-CH, 100 V, 5 A, DNH0008A (VSONP-8); Alternate Manufacturer: None; Manufacturer: Texas Instruments; SizeZ_mm: 0.9; ChType: N; Value2: 7.2 nC; VdsMax_V: 100V; SizeX_mm: 3.3; SizeAreaWB_mm2: 18.49; Vgs_V: 20V; QgTyp_nC: 7.2; Value: 100V; SizeArea_mm2: 10.89; AEC Category: Q101; IdsMax_A: 5A; ChMode: Enhancement; PartNumber: CSD19538Q3A; ComponentLink1Description: Datasheet link; SizeY_mm: 3.3; CompType: MOSFET; AEC Qualified: N; RoHS: Y; PackageReference: DNH0008A; MountType: SMT; ComponentLink1URL: http://www.ti.com/lit/ds/symlink/csd19538q3a.pdf
Q2 = CMP-0074710-1: Transistor, NPN, 150 V, 1 A, AEC-Q101, SOT-23; Manufacturer: Diodes Inc.; TaMin_C: -55°C; HfeMax: 300.0; SizeAreaWB_mm2: 14.0; Value1: 1 A; Vceo_V: 150V; U/M: EA; Value: 150 V; TaMax_C: 150°C; IcRated_A: 1A; SizeZ_mm: 1.1; SizeX_mm: 2.5; SizeY_mm: 3.0; SizeArea_mm2: 7.5; CompType: BJT; PNP: 0.0; AEC Qualified: Y; NPN: 1.0; Vcesat1_V: 3dV; AEC Category: Q101; ComponentLink1URL: https://www.diodes.com/assets/Datasheets/FMMT495.pdf; Supplier Part Number 2: 522-FMMT495TA; Publisher: Texas Instruments; Supplier 2: Mouser; Published: 2008-07-31; RoHS: Y; MountType: SMT; Supplier 1: Digi-Key; PackageReference: SOT-23; Value2: 300.0; PartNumber: FMMT495TA; LatestRevisionDate: 2017-06-26; ComponentLink1Description: Datasheet link; Supplier Part Number 1: FMMT495CT-ND
Q3 = CMP-0000370-2: Transistor, PNP, 200 V, 0.3 A, SOT-23; Manufacturer: Diodes Inc.; TaMax_C: 150°C; Value2: 300; Value1: 0.3 A; Vcesat1_V: 2dV; SizeX_mm: 2.5; SizeY_mm: 3; TaMin_C: -55°C; IcRated_A: 3dA; CompType: BJT; SizeZ_mm: 1.1; AEC Qualified: N; Value: 200 V; SizeArea_mm2: 7.5; NPN: 0; Vceo_V: 200V; PNP: 1; AEC Category: Q101; SizeAreaWB_mm2: 14; U/M: EA; Supplier 2: Mouser; Supplier 1: Digi-Key; Supplier Part Number 1: FMMT596CT-ND; Supplier Part Number 2: 522-FMMT596TA; PartNumber: FMMT596TA; LatestRevisionDate: 2017-03-09; Publisher: Texas Instruments; ComponentLink1Description: Datasheet link; HfeMax: 300; Published: 2008-07-31; RoHS: Y; PackageReference: SOT-23; MountType: SMT; ComponentLink1URL: http://www.diodes.com/_files/datasheets/FMMT596.pdf
R33 = RT0603BRD0720RL: RES, 20.0, 0.1%, 0.1 W, 0603; Manufacturer: Yageo America; CompType: Resistor; Value: 20.0; Res_ohm: 20; Value_Code: 20R0; Tolerance_%: 0.1; Value2: 0.1W; VDC_V: 75; TempCo: 25 ppm/C; SizeArea_mm2: 1.28; SizeX_mm: 1.6; SizeY_mm: 0.8; SizeZ_mm: 1; EIA_Code: E192; U/M: EA; AEC Category: Q200; Green_Lifecycle: Active; Green_REACh: Passed; SymbolVersion: 2009-05-29; PartNumber: RT0603BRD0720RL; PackageReference: 0603; RoHS: Y; Value1: 0.1%; Power_W: 0.1; MountType: SMT; Technology: Thin Film; Published: 2008-06-26; Publisher: Texas Instruments; LatestRevisionDate: 2017-06-13; ComponentLink1Description: Datasheet link; ComponentLink1URL: http://www.yageo.com/pdf/PYu-RT_1-to-0.05_RoHS_L_3.pdf; AEC Qualified: ?; Green_EU RoHS: Passed with Exemption; Green_EU RoHS-2: Passed
R34 = CMP-0025885-5: RES, 0, 5%, 0.1 W, 0603; Manufacturer: Yageo; Power_W: 100mW; TempCo: 200 ppm/C; Value_Code: 0000; Value: 0; EIA_Code: E24; SizeX_mm: 1.6; SizeZ_mm: 1; Value2: 0.1W; SizeArea_mm2: 1.28; AEC Qualified: N; VDC_V: 75V; AEC Category: Q200; SizeY_mm: 0.8; SizeAreaWB_mm2: 4.68; Supplier Part Number 2: 603-RC0603JR-070RL; Supplier 2: Mouser; Supplier Part Number 3: 9233130; Supplier 3: Farnell; RoHS: Y; Value1: 5%; MountType: SMT; Supplier 1: Digi-Key; PackageReference: 0603; Tolerance_%: 5%; Res_ohm: 0; CompType: Resistor; PartNumber: RC0603JR-070RL; ComponentLink1Description: Datasheet link; Supplier Part Number 1: 311-0.0GRCT-ND; Technology: Thick Film; ComponentLink1URL: http://www.yageo.com/pdf/Pu-RC0603_51_PbFree_L_2.pdf; AEC Grade: N/A
R35 = CMP-0025700-4: RES, 100, 5%, 0.1 W, AEC-Q200 Grade 0, 0603; Manufacturer: Vishay-Dale; Power_W: 100mW; TempCo: 200 ppm/C; Value_Code: 100R; Value: 100; EIA_Code: E24; SizeX_mm: 1.6; SizeY_mm: 0.8; SizeZ_mm: 1; Value2: 0.1W; SizeArea_mm2: 1.28; AEC Qualified: Y; VDC_V: 75V; AEC Category: Q200; AEC Grade: 0; Supplier Part Number 2: 59M6764; Supplier 2: Newark; Supplier Part Number 3: 71-CRCW0603J-100-E3; Supplier 3: Mouser; RoHS: E; Value1: 5%; MountType: SMT; Supplier 1: Digi-Key; PackageReference: 0603; Tolerance_%: 5%; Res_ohm: 100; CompType: Resistor; PartNumber: CRCW0603100RJNEA; ComponentLink1Description: Datasheet link; Supplier Part Number 1: 541-100GCT-ND; Technology: Thick Film; ComponentLink1URL: http://www.vishay.com/docs/20035/dcrcwe3.pdf
R36 = RC0603JR-0733KL: RES, 33 k, 5%, 0.1 W, 0603; Manufacturer: Yageo America; CompType: Resistor; Value: 33k; Res_ohm: 33000; Value_Code: 33k0; Tolerance_%: 5; Power_W: 0.1; Value2: 0.1W; VDC_V: 50; TempCo: 100 ppm/C; SizeArea_mm2: 1.28; SizeX_mm: 1.6; SizeY_mm: 0.8; SizeZ_mm: 1; EIA_Code: E24; U/M: EA; AEC Category: Q200; SymbolVersion: 2009-05-29; PartNumber: RC0603JR-0733KL; PackageReference: 0603; RoHS: Y; Value1: 5%; MountType: SMT; Technology: Thick Film; Published: 2008-06-26; Publisher: Texas Instruments; LatestRevisionDate: 2017-06-13; ComponentLink1Description: Datasheet link; ComponentLink1URL: http://www.yageo.com/pdf/Pu-RC0603_51_PbFree_L_2.pdf; Supplier 1: Digi-Key; Supplier Part Number 1: 311-33KGRCT-ND; Supplier 2: Mouser; Supplier Part Number 2: 603-RC0603JR-0733KL; Supplier 3: Farnell; Supplier Part Number 3: 9233563; AEC Qualified: ?
R37 R44 = CMP-0082530-1: RES, 100 k, 1%, 0.1 W, 0603; Manufacturer: Panasonic; PartNumber: ERJ-3EKF1003V; Power_W: 100mW; TempCo: 200 ppm/C; SizeAreaWB_mm2: 4.68; Value1: 5%; Value: 100k; EIA_Code: E24; SizeX_mm: 1.6; SizeY_mm: 0.8; SizeZ_mm: 1; Value2: 0.1W; SizeArea_mm2: 1.28; AEC Qualified: N; VDC_V: 75V; AEC Category: Q200; ComponentLink1URL: http://www.vishay.com/docs/28773/crcwce3.pdf; Supplier 2: Mouser; Value_Code: 100k; RoHS: E; MountType: SMT; Supplier 1: Digi-Key; PackageReference: 0603; Tolerance_%: 1%; Res_ohm: 100k; CompType: Resistor; ComponentLink1Description: Datasheet link; AEC Grade: N/A; Supplier Part Number 1: P100KHCT-ND; Technology: Thick Film
R38 = CRCW0603200RFKEA: RES, 200, 1%, 0.1 W, 0603; Manufacturer: Vishay-Dale; CompType: Resistor; Value: 200; Value_Code: 200R; Tolerance_%: 1; Power_W: 0.1; Value2: 0.1W; VDC_V: 75; TempCo: 100 ppm/C; SizeArea_mm2: 1.28; SizeX_mm: 1.6; SizeY_mm: 0.8; EIA_Code: E96; U/M: EA; AEC Category: Q200; Green_Lifecycle: Active; Green_REACh: Passed; SymbolVersion: 2009-05-29; PartNumber: CRCW0603200RFKEA; PackageReference: 0603; RoHS: Y; Res_ohm: 200; Value1: 1%; MountType: SMT; Technology: Thick Film; SizeZ_mm: 1; Published: 2008-06-26; Publisher: Texas Instruments; LatestRevisionDate: 2017-06-13; ComponentLink1Description: Datasheet link; ComponentLink1URL: http://www.vishay.com/docs/20035/dcrcwe3.pdf; Supplier 1: Digi-Key; Supplier Part Number 1: 541-200HCT-ND; Supplier 2: Newark; Supplier Part Number 2: 52K8273; Supplier 3: Mouser; Supplier Part Number 3: 71-CRCW0603-200-E3; AEC Qualified: ?; Green_EU RoHS: Passed with Exemption; Green_EU RoHS-2: Passed
R39 = RC0603FR-0768KL: RES, 68.0 k, 1%, 0.1 W, 0603; Manufacturer: Yageo America; CompType: Resistor; Value: 68.0k; Res_ohm: 68000; Value_Code: 68k0; Tolerance_%: 1; Power_W: 0.1; Value2: 0.1W; VDC_V: 150; TempCo: 200 ppm/C; SizeArea_mm2: 1.28; SizeX_mm: 1.6; SizeY_mm: 0.8; U/M: EA; AEC Category: Q200; Green_Lifecycle: Active; Green_REACh: Passed; SymbolVersion: 2009-05-29; PartNumber: RC0603FR-0768KL; PackageReference: 0603; RoHS: Y; Value1: 1%; MountType: SMT; Technology: Thick Film; SizeZ_mm: 1; Published: 2008-06-26; Publisher: Texas Instruments; LatestRevisionDate: 2017-06-13; ComponentLink1Description: Datasheet link; ComponentLink1URL: http://www.yageo.com/pdf/Pu-RC0603_51_PbFree_L_2.pdf; Supplier 1: Digi-Key; Supplier Part Number 1: 311-68.0KHRCT-ND; Supplier 2: Mouser; Supplier Part Number 2: 603-RC0603FR-0768KL; Supplier 3: Farnell; Supplier Part Number 3: 9238700; AEC Qualified: ?; Green_EU RoHS: Passed with Exemption; Green_EU RoHS-2: Passed
R40 = ERJ-2RKF4701X: RES, 4.70 k, 1%, 0.1 W, 0402; Manufacturer: Panasonic; CompType: Resistor; Value: 4.70k; Res_ohm: 4700; Value_Code: 4k70; Tolerance_%: 1; Power_W: 0.1; Value2: 0.1W; VDC_V: 50; TempCo: 100 ppm/C; SizeArea_mm2: 0.5; SizeZ_mm: 0.6; U/M: EA; AEC Category: Q200; Green_Lifecycle: Active; Green_REACh: Passed; SymbolVersion: 2009-05-29; PartNumber: ERJ-2RKF4701X; PackageReference: 0402; RoHS: Y; Value1: 1%; MountType: SMT; Technology: Thick Film; SizeX_mm: 1; SizeY_mm: 0.5; Published: 2008-06-26; Publisher: Texas Instruments; LatestRevisionDate: 2017-06-12; ComponentLink1Description: Datasheet link; ComponentLink1URL: http://industrial.panasonic.com/www-data/pdf/AOA0000/AOA0000CE2.pdf; Supplier 1: Digi-Key; Supplier Part Number 1: P4.70KLCT-ND; Supplier 2: Newark; Supplier Part Number 2: 64R5288; Supplier 3: Mouser; Supplier Part Number 3: 667-ERJ-2RKF4701X; AEC Qualified: ?; Green_EU RoHS: Passed with Exemption; Green_EU RoHS-2: Passed
R41 = CMP-0016223-3: RES 0.05 OHM 1% 1/2W 2010; Manufacturer: Vishay; PartNumber: WSL2010R0500FEA; Power_W: 750mW; TempCo: 100 ppm/C; Value_Code: 11R0; Value: 50m; EIA_Code: E96; Res_ohm: 11; SizeX_mm: 5; SizeY_mm: 2.5; SizeZ_mm: 1.66; Value2: 0.75W; SizeArea_mm2: 12.5; CompType: Resistor; AEC Qualified: Y; VDC_V: 400V; AEC Grade: 0; AEC Category: Q200; RoHS: E; Value1: 1%; MountType: SMT; Supplier 1: Digi-Key; PackageReference: 2010; Tolerance_%: 1%; ComponentLink1Description: Datasheet link; Supplier Part Number 1: WSLE-.05CT-ND; Technology: Thick Film; ComponentLink1URL: http://www.vishay.com/docs/20035/dcrcwe3.pdf
R42 = RT0603BRD07298KL: RES SMD 294K OHM 1% 1/10W 0603; Manufacturer: Panasonic Electronic Components; CompType: Resistor; Value: 298k; Res_ohm: 298000; Tolerance_%: 0.1; Value1: 0.1%; Value2: 0.1W; VDC_V: 75; TempCo: 25 ppm/C; SizeArea_mm2: 1.28; SizeX_mm: 1.6; SizeY_mm: 0.8; SizeZ_mm: 1; EIA_Code: E192; U/M: EA; AEC Category: Q200; SymbolVersion: 2009-05-29; PartNumber: ERJ-3EKF2943V; PackageReference: 0603; RoHS: Y; Value_Code: 294k; Power_W: 0.1; MountType: SMT; Technology: Thin Film; Published: 2008-06-26; Publisher: Texas Instruments; LatestRevisionDate: 2017-06-13; ComponentLink1Description: Datasheet link; ComponentLink1URL: http://www.yageo.com/pdf/PYu-RT_1-to-0.05_RoHS_L_3.pdf; AEC Qualified: ?
R45 = RG1608P-4751-B-T5: RES SMD 5.11KOHM 0.1% 1/10W 0603; Manufacturer: Panasonic Electronic Components; CompType: Resistor; Value: 5.11k; Res_ohm: 4750; Tolerance_%: 0.1; Value2: 0.1W; VDC_V: 75; TempCo: 25 ppm/C; SizeArea_mm2: 1.28; SizeX_mm: 1.6; SizeY_mm: 0.8; SizeZ_mm: 1; EIA_Code: E192; U/M: EA; AEC Category: Q200; SymbolVersion: 2009-05-29; PartNumber: ERA-3AEB5111V; PackageReference: 0603; RoHS: Y; Value_Code: 5.11k; Value1: 0.1%; Power_W: 0.1; MountType: SMT; Technology: Metal Film; Published: 2008-06-26; Publisher: Texas Instruments; LatestRevisionDate: 2017-06-13; ComponentLink1Description: Datasheet link; ComponentLink1URL: http://www.susumu.co.jp/english/pdf/products-j01-01.pdf; Supplier Part Number 1: P4.7KDBCT-ND; AEC Qualified: ?
R54 R71 R126 = 5106: RES, 0, 1%, 0.5 W, 0805; Manufacturer: Keystone; CompType: Resistor; Value: 0; Tolerance_%: 1; Power_W: 0.5; Value2: 0.5W; TempCo: ppm/C; SizeArea_mm2: 2.5; SizeX_mm: 2; SizeY_mm: 1.25; SizeZ_mm: 0.84; U/M: EA; AEC Category: Q200; AEC Qualified: N; SymbolVersion: 2009-05-29; PartNumber: 5106; PackageReference: 0805; RoHS: Y; Res_ohm: 0; Value_Code: 0; Value1: 1%; MountType: SMT; Technology: Metal Element; Published: 2008-06-26; Publisher: Texas Instruments; LatestRevisionDate: 2017-06-23; ComponentLink1Description: Datasheet link; ComponentLink1URL: http://www.keyelco.com/product-pdf.cfm?p=14039; Supplier 1: Digi-Key; Supplier Part Number 1: 36-5106CT-ND; AEC Grade: N/A
R123 = CRCW040222R0JNED: RES, 22, 5%, 0.063 W, 0402; Manufacturer: Vishay-Dale; CompType: Resistor; Value: 22; Value_Code: 22R0; Tolerance_%: 5; Power_W: 0.063; Value2: 0.063W; VDC_V: 50; TempCo: 200 ppm/C; SizeArea_mm2: 0.5; SizeX_mm: 1; SizeZ_mm: 0.6; EIA_Code: E24; U/M: EA; AEC Category: Q200; SymbolVersion: 2009-05-29; PartNumber: CRCW040222R0JNED; PackageReference: 0402; RoHS: Y; Res_ohm: 22; Value1: 5%; MountType: SMT; Technology: Thick Film; SizeY_mm: 0.5; Published: 2008-06-26; Publisher: Texas Instruments; LatestRevisionDate: 2017-06-12; ComponentLink1Description: Datasheet link; ComponentLink1URL: http://www.vishay.com/docs/20035/dcrcwe3.pdf; Supplier 1: Digi-Key; Supplier Part Number 1: 541-22JCT-ND; Supplier 2: Newark; Supplier Part Number 2: 59M6716; Supplier 3: Mouser; Supplier Part Number 3: 71-CRCW0402J-22-E3; AEC Qualified: ?
R144 R145 = RC0201JR-0710RL: RES, 10, 5%, 0.05 W, 0201; Manufacturer: Yageo America; CompType: Resistor; Value: 10; Value_Code: 10R0; Tolerance_%: 5; Power_W: 0.05; Value2: 0.05W; VDC_V: 25; TempCo: 350 ppm/C; SizeArea_mm2: 0.18; SizeX_mm: 0.6; SizeY_mm: 0.3; SizeZ_mm: 0.26; EIA_Code: E24; U/M: EA; AEC Category: Q200; AEC Qualified: N; SymbolVersion: 2009-05-29; PartNumber: RC0201JR-0710RL; PackageReference: 0201; RoHS: Y; Res_ohm: 10; Value1: 5%; MountType: SMT; Technology: Thick Film; Published: 2016-10-14; Publisher: Texas Instruments; LatestRevisionDate: 2017-04-07; ComponentLink1Description: Datasheet link; ComponentLink1URL: http://www.yageo.com/documents/recent/PYu-RC_Group_51_RoHS_L_5.pdf; Supplier 1: Digi-Key; Supplier Part Number 1: 311-10NCT-ND; Supplier 2: Mouser; Supplier Part Number 2: 603-RC0201JR-0710RL; AEC Grade: N/A
R159 = CSR1206FK20L0: RES, 0.02, 1%, 0.5 W, 1206; Manufacturer: Stackpole Electronics Inc; CompType: Resistor; Value: 0.02; Value_Code: R020; Tolerance_%: 1; Power_W: 0.5; Value2: 0.5W; TempCo: 100 ppm/C; SizeArea_mm2: 5.12; SizeX_mm: 3.2; SizeY_mm: 1.6; SizeZ_mm: 1.35; EIA_Code: E96; U/M: EA; AEC Category: Q200; SymbolVersion: 2009-05-29; PartNumber: CSR1206FK20L0; PackageReference: 1206; RoHS: Y; Res_ohm: 0.02; Value1: 1%; MountType: SMT; Technology: Thick Film; Published: 2008-06-26; Publisher: Texas Instruments; LatestRevisionDate: 2017-06-12; ComponentLink1Description: Datasheet link; ComponentLink1URL: http://www.seielect.com/Catalog/SEI-csr.pdf; Supplier 1: Digi-Key; Supplier Part Number 1: CSR1206FK20L0CT-ND; AEC Qualified: ?
R185 R186 = CMP-0028071-1: RES SMD 10K OHM 1% 1/20W 0201; Manufacturer: Samsung Electro-Mechanics; PartNumber: RC0603F103CS; Power_W: 50mW; TempCo: 200 ppm/C; Value_Code: 10k0; U/M: EA; Value: 10.0k; EIA_Code: E96; SizeX_mm: 0.6; SizeY_mm: 0.3; SizeZ_mm: 0.26; Value2: 0.05W; SizeArea_mm2: 0.18; AEC Qualified: N; VDC_V: 25V; AEC Category: Q200; ComponentLink1URL: http://www.yageo.com/documents/recent/PYu-RC_Group_51_RoHS_L_5.pdf; Publisher: Texas Instruments; Published: 2016-10-14; RoHS: Y; Value1: 1%; MountType: SMT; Supplier 1: Digi-Key; PackageReference: 0201; Tolerance_%: 1%; Res_ohm: 10k; CompType: Resistor; LatestRevisionDate: 2017-03-09; ComponentLink1Description: Datasheet link; AEC Grade: N/A; Supplier Part Number 1: 1276-3670-1-ND; Technology: Thick Film
R200 R201 = RT0603BRD0710KL: RES, 10.0 k, 0.1%, 0.1 W, 0603; Manufacturer: Yageo America; CompType: Resistor; Value: 10.0k; Res_ohm: 10000; Value_Code: 10k0; Tolerance_%: 0.1; Value2: 0.1W; VDC_V: 75; TempCo: 25 ppm/C; SizeArea_mm2: 1.28; SizeX_mm: 1.6; SizeY_mm: 0.8; SizeZ_mm: 1; EIA_Code: E192; U/M: EA; AEC Category: Q200; Green_Lifecycle: Active; Green_REACh: Passed; SymbolVersion: 2009-05-29; PartNumber: RT0603BRD0710KL; PackageReference: 0603; RoHS: Y; Value1: 0.1%; Power_W: 0.1; MountType: SMT; Technology: Thin Film; Published: 2008-06-26; Publisher: Texas Instruments; LatestRevisionDate: 2017-06-13; ComponentLink1Description: Datasheet link; ComponentLink1URL: http://www.yageo.com/pdf/PYu-RT_1-to-0.05_RoHS_L_3.pdf; AEC Qualified: ?; Green_EU RoHS: Passed with Exemption; Green_EU RoHS-2: Passed
R235 = ERJ-1GN0R00C: RES, 0, 5%, 0.05 W, AEC-Q200 Grade 0, 0201; Manufacturer: Panasonic; CompType: Resistor; Value: 0; Value_Code: 0000; Tolerance_%: 5; Power_W: 0.05; Value2: 0.05W; TempCo: ppm/C; SizeArea_mm2: 0.18; SizeX_mm: 0.6; SizeY_mm: 0.3; SizeZ_mm: 0.26; EIA_Code: E24; U/M: EA; AEC Category: Q200; AEC Qualified: Y; SymbolVersion: 2009-05-29; PartNumber: ERJ-1GN0R00C; PackageReference: 0201; RoHS: Y; Res_ohm: 0; Value1: 5%; MountType: SMT; Technology: Thick Film; Published: 2016-10-14; Publisher: Texas Instruments; LatestRevisionDate: 2017-04-07; ComponentLink1Description: Datasheet link; ComponentLink1URL: https://industrial.panasonic.com/cdbs/www-data/pdf/RDA0000/AOA0000C281.pdf; Supplier 1: Digi-Key; Supplier Part Number 1: P15979CT-ND; Supplier 2: Newark; Supplier Part Number 2: 51W5934; Supplier 3: Mouser; Supplier Part Number 3: 667-ERJ-1GN0R00C; AEC Grade: 0
R245 = ERJ-2GE0R00X: RES, 0, 5%, 0.063 W, 0402; Manufacturer: Panasonic; CompType: Resistor; Value: 0; Value_Code: 0000; Tolerance_%: 5; Power_W: 0.063; Value2: 0.063W; VDC_V: 50; TempCo: 600 ppm/C; SizeArea_mm2: 0.5; SizeX_mm: 1; SizeZ_mm: 0.6; EIA_Code: E24; U/M: EA; AEC Category: Q200; Green_Lifecycle: Active; Green_REACh: Passed; SymbolVersion: 2009-05-29; PartNumber: ERJ-2GE0R00X; PackageReference: 0402; RoHS: Y; Res_ohm: 0; Value1: 5%; MountType: SMT; Technology: Thick Film; SizeY_mm: 0.5; Published: 2008-06-26; Publisher: Texas Instruments; LatestRevisionDate: 2017-06-12; ComponentLink1Description: Datasheet link; ComponentLink1URL: http://www.panasonic.com/industrial/components/pdf/AOA0000CE1.pdf; Supplier 1: Digi-Key; Supplier Part Number 1: P0.0JCT-ND; Supplier 2: Newark; Supplier Part Number 2: 65T8307; Supplier 3: Mouser; Supplier Part Number 3: 667-ERJ-2GE0R00X; AEC Qualified: ?; Green_EU RoHS: Passed with Exemption; Green_EU RoHS-2: Passed
U3 = CMP-0071985-2: 40V Wide Vin Low-Side N-Channel Controller for Switching Regulators, DGK0008A (VSSOP-8); Manufacturer: Texas Instruments; High-Reliability: Y; CompType: IC; AEC Category: Q200; AEC Qualified: N; SizeAreaWB_mm2: 23.6; SizeArea_mm2: 14.7; SizeX_mm: 4.9; SizeY_mm: 3; SizeZ_mm: 1.1; ComponentLink1URL: http://www.ti.com/lit/ds/symlink/lm3488.pdf; PackageReference: DGK0008A; Code_JEDEC: MO-187-AA; PartNumber: LM3488MMX/NOPB; RoHS: Y; ComponentLink1Description: Datasheet Link; PackageDescription: VSSOP-8; ComponentLink2Description: Product Folder; ComponentLink2URL: http://www.ti.com/product/lm3488; ComponentLink3Description: Online Datasheet; ComponentLink3URL: http://www.ti.com/product/lm3488/datasheet; MountType: SMT
U24 = CMP-0065450-1: 28-V, Bi-Directional, Zero-Drift, Low-/High-Side, I2C Out Current/Power Monitor w/ Alert in WCSP, YFF0012AKAD (DSBGA-12); Alternate PartNumber: INA231AIYFFT; Alternate Manufacturer: Texas Instruments; Green_Lifecycle: Active; SizeAreaWB_mm2: 6.313872; Green_REACh: Passed; U/M: EA; SizeZ_mm: 0.625; SizeX_mm: 1.388; SizeY_mm: 1.644; SizeArea_mm2: 2.281872; CompType: IC; ComponentLink1URL: http://www.ti.com/lit/ds/symlink/ina231.pdf; Publisher: Texas Instruments; PackageDescription: DSBGA-12; RoHS: Y; Footprint Path 6: C:\AltiumLibraries\Footprints\TI\.PcbLib; MountType: SMT; Green_EU RoHS-2: Passed; Manufacturer: Texas Instruments; Green_EU RoHS: Passed; PackageReference: YFF0012AKAD; LatestRevisionDate: 2017-06-09; PartNumber: INA231AIYFFR; ComponentLink1Description: Datasheet Link